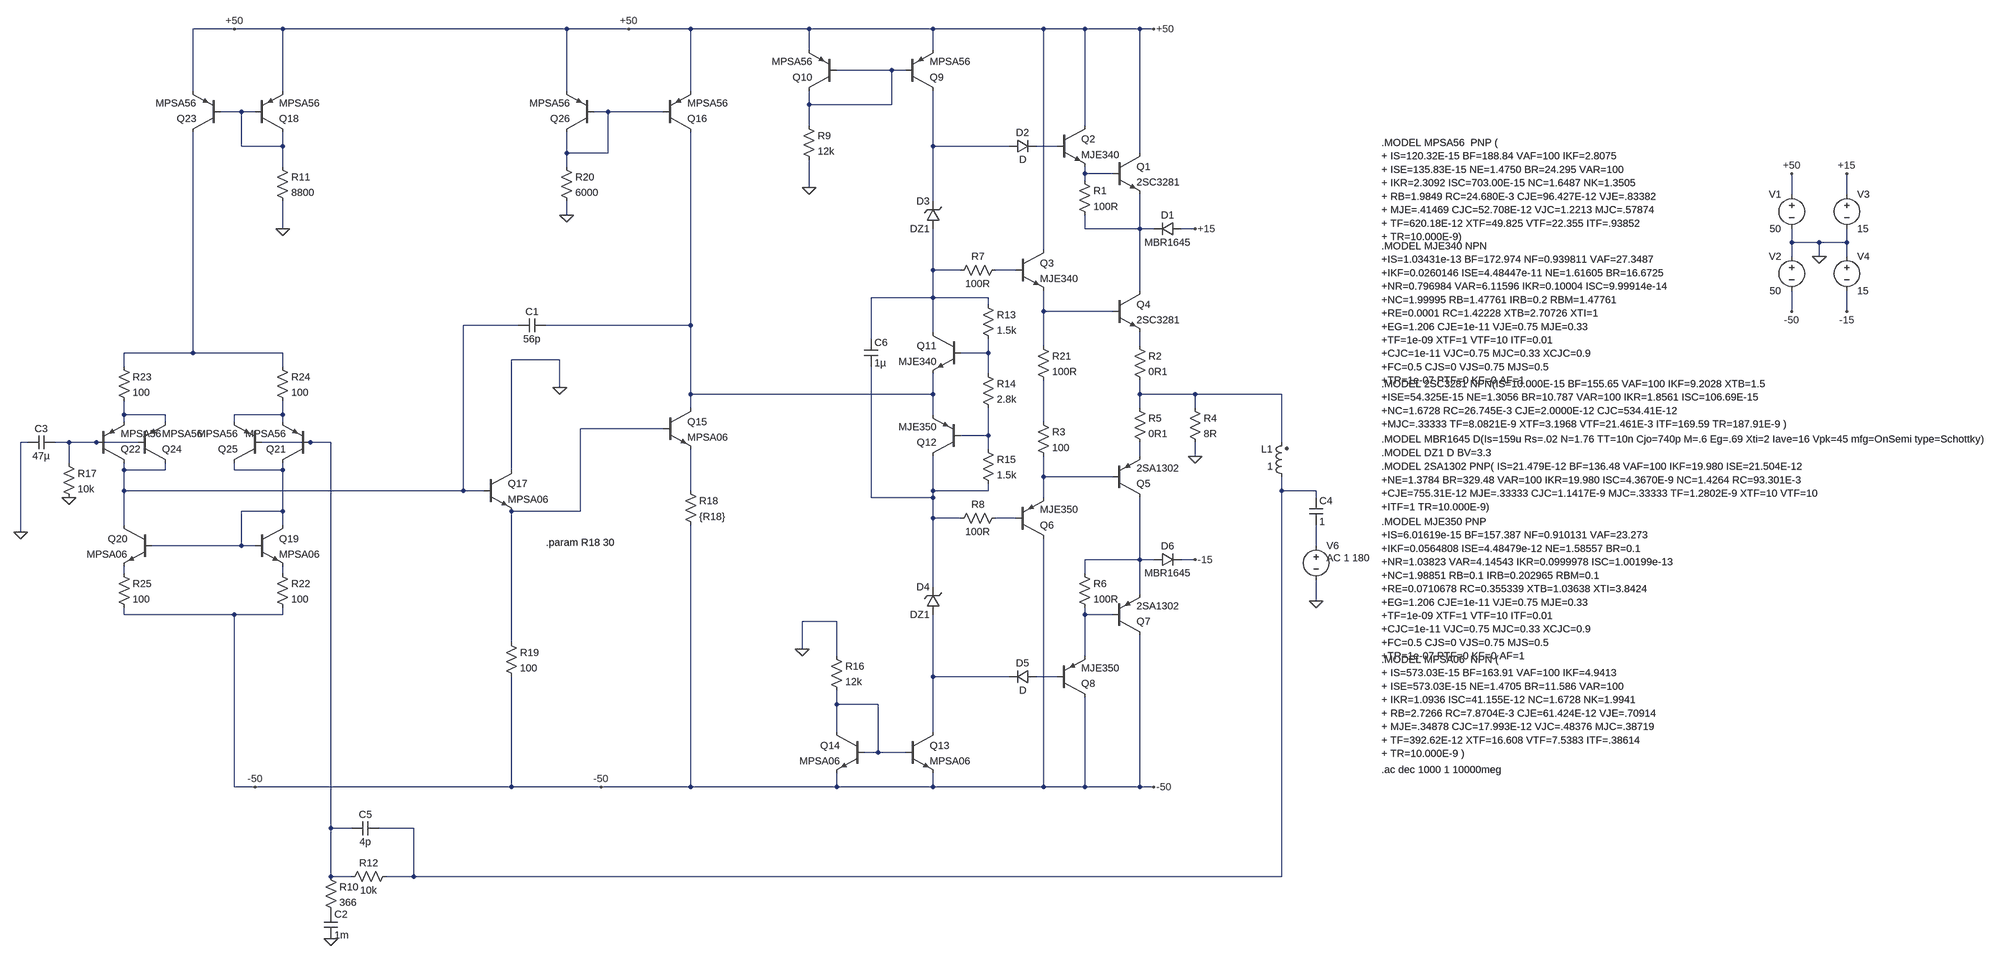
[diagram p0: schematic ganancia de lazo.asc]
ganancia de lazo.asc, the LTspice schematic file:
Version 4
SHEET 1 4608 680
WIRE 80 -1584 -16 -1584
WIRE 192 -1584 80 -1584
WIRE 896 -1584 192 -1584
WIRE 1040 -1584 896 -1584
WIRE 1184 -1584 1040 -1584
WIRE 1472 -1584 1184 -1584
WIRE 1760 -1584 1472 -1584
WIRE 2016 -1584 1760 -1584
WIRE 2112 -1584 2016 -1584
WIRE 2240 -1584 2112 -1584
WIRE 2272 -1584 2240 -1584
WIRE 1472 -1536 1472 -1584
WIRE 1760 -1536 1760 -1584
WIRE 1664 -1488 1536 -1488
WIRE 1696 -1488 1664 -1488
WIRE -16 -1440 -16 -1584
WIRE 192 -1440 192 -1584
WIRE 896 -1440 896 -1584
WIRE 1184 -1440 1184 -1584
WIRE 1472 -1408 1472 -1440
WIRE 1664 -1408 1664 -1488
WIRE 1664 -1408 1472 -1408
WIRE 96 -1392 48 -1392
WIRE 128 -1392 96 -1392
WIRE 992 -1392 960 -1392
WIRE 1120 -1392 992 -1392
WIRE 1472 -1360 1472 -1408
WIRE 2112 -1360 2112 -1584
WIRE 96 -1312 96 -1392
WIRE 192 -1312 192 -1344
WIRE 192 -1312 96 -1312
WIRE 1760 -1312 1760 -1440
WIRE 1936 -1312 1760 -1312
WIRE 2048 -1312 2000 -1312
WIRE 896 -1296 896 -1344
WIRE 992 -1296 992 -1392
WIRE 992 -1296 896 -1296
WIRE 2240 -1296 2240 -1584
WIRE 192 -1264 192 -1312
WIRE 896 -1264 896 -1296
WIRE 2112 -1248 2112 -1264
WIRE 2176 -1248 2112 -1248
WIRE 2112 -1232 2112 -1248
WIRE 1472 -1216 1472 -1280
WIRE 3936 -1200 3936 -1248
WIRE 4064 -1200 4064 -1248
WIRE 1760 -1184 1760 -1312
WIRE 896 -1152 896 -1184
WIRE 192 -1120 192 -1184
WIRE 2112 -1120 2112 -1152
WIRE 2240 -1120 2240 -1200
WIRE 2240 -1120 2112 -1120
WIRE 2272 -1120 2240 -1120
WIRE 2368 -1120 2336 -1120
WIRE 3936 -1088 3936 -1120
WIRE 4000 -1088 3936 -1088
WIRE 4064 -1088 4064 -1120
WIRE 4064 -1088 4000 -1088
WIRE 2016 -1072 2016 -1584
WIRE 3936 -1056 3936 -1088
WIRE 4000 -1056 4000 -1088
WIRE 4064 -1056 4064 -1088
WIRE 1760 -1024 1760 -1120
WIRE 1824 -1024 1760 -1024
WIRE 1952 -1024 1904 -1024
WIRE 2240 -976 2240 -1120
WIRE 1760 -960 1760 -1024
WIRE 1760 -960 1616 -960
WIRE 1888 -960 1760 -960
WIRE 1888 -944 1888 -960
WIRE 2016 -928 2016 -976
WIRE 2176 -928 2016 -928
WIRE 3936 -928 3936 -976
WIRE 4064 -928 4064 -976
WIRE 784 -896 656 -896
WIRE 1184 -896 1184 -1344
WIRE 1184 -896 848 -896
WIRE 1760 -880 1760 -960
WIRE 1616 -864 1616 -960
WIRE 2016 -848 2016 -928
WIRE 2240 -848 2240 -880
WIRE -16 -832 -16 -1344
WIRE -16 -832 -176 -832
WIRE 192 -832 -16 -832
WIRE 1888 -832 1888 -864
WIRE 1888 -832 1824 -832
WIRE 880 -816 768 -816
WIRE -176 -800 -176 -832
WIRE 192 -800 192 -832
WIRE 1888 -784 1888 -832
WIRE 880 -752 880 -816
WIRE 1184 -736 1184 -896
WIRE 1760 -736 1760 -784
WIRE 1760 -736 1184 -736
WIRE 2240 -736 2240 -768
WIRE 2368 -736 2240 -736
WIRE 2752 -736 2368 -736
WIRE 1184 -704 1184 -736
WIRE 2240 -704 2240 -736
WIRE 2368 -704 2368 -736
WIRE -176 -688 -176 -720
WIRE -80 -688 -176 -688
WIRE 192 -688 192 -720
WIRE 192 -688 80 -688
WIRE 1760 -688 1760 -736
WIRE -176 -672 -176 -688
WIRE -80 -672 -80 -688
WIRE 80 -672 80 -688
WIRE 192 -672 192 -688
WIRE 2016 -672 2016 -768
WIRE 1120 -656 928 -656
WIRE 1888 -640 1888 -704
WIRE 1888 -640 1824 -640
WIRE -400 -624 -416 -624
WIRE -304 -624 -336 -624
WIRE -240 -624 -304 -624
WIRE -144 -624 -240 -624
WIRE 256 -624 144 -624
WIRE 304 -624 256 -624
WIRE 2752 -624 2752 -736
WIRE 1888 -608 1888 -640
WIRE 2240 -592 2240 -624
WIRE 2368 -592 2368 -624
WIRE -304 -576 -304 -624
WIRE -176 -560 -176 -576
WIRE -80 -560 -80 -576
WIRE -80 -560 -176 -560
WIRE 80 -560 80 -576
WIRE 192 -560 192 -576
WIRE 192 -560 80 -560
WIRE 768 -560 768 -816
WIRE 2016 -544 2016 -592
WIRE 2176 -544 2016 -544
WIRE -176 -512 -176 -560
WIRE 656 -512 656 -896
WIRE 656 -512 -176 -512
WIRE 704 -512 656 -512
WIRE 1184 -512 1184 -608
WIRE 1760 -512 1760 -592
WIRE 1888 -512 1888 -528
WIRE 1888 -512 1760 -512
WIRE 2752 -512 2752 -544
WIRE 2832 -512 2752 -512
WIRE 1616 -496 1616 -800
WIRE 1760 -496 1760 -512
WIRE 1760 -496 1616 -496
WIRE 2016 -496 2016 -544
WIRE 2832 -496 2832 -512
WIRE 192 -464 192 -560
WIRE 192 -464 96 -464
WIRE 928 -464 928 -656
WIRE 928 -464 768 -464
WIRE 1760 -448 1760 -496
WIRE 1824 -448 1760 -448
WIRE 1952 -448 1904 -448
WIRE -176 -432 -176 -512
WIRE 192 -432 192 -464
WIRE -416 -416 -416 -624
WIRE 96 -384 96 -464
WIRE 96 -384 -112 -384
WIRE 128 -384 96 -384
WIRE 2832 -384 2832 -432
WIRE 2240 -352 2240 -496
WIRE 2240 -352 2112 -352
WIRE 2272 -352 2240 -352
WIRE 2368 -352 2336 -352
WIRE -176 -320 -176 -336
WIRE 192 -320 192 -336
WIRE 2112 -320 2112 -352
WIRE 1760 -288 1760 -448
WIRE 2240 -272 2240 -352
WIRE 2832 -256 2832 -304
WIRE -176 -224 -176 -240
WIRE 80 -224 -176 -224
WIRE 192 -224 192 -240
WIRE 192 -224 80 -224
WIRE 2112 -224 2112 -240
WIRE 2176 -224 2112 -224
WIRE 1536 -208 1456 -208
WIRE 768 -160 768 -464
WIRE 1456 -144 1456 -208
WIRE 1536 -128 1536 -208
WIRE 2112 -128 2112 -224
WIRE 1760 -80 1760 -224
WIRE 1936 -80 1760 -80
WIRE 2048 -80 2000 -80
WIRE 1536 -16 1536 -48
WIRE 1632 -16 1536 -16
WIRE 1536 48 1536 -16
WIRE 1760 48 1760 -80
WIRE 1632 96 1632 -16
WIRE 1632 96 1600 96
WIRE 1696 96 1632 96
WIRE 80 176 80 -224
WIRE 128 176 80 176
WIRE 768 176 768 -80
WIRE 768 176 128 176
WIRE 976 176 768 176
WIRE 1184 176 1184 -432
WIRE 1184 176 976 176
WIRE 1536 176 1536 144
WIRE 1536 176 1184 176
WIRE 1760 176 1760 144
WIRE 1760 176 1536 176
WIRE 2016 176 2016 -400
WIRE 2016 176 1760 176
WIRE 2112 176 2112 -32
WIRE 2112 176 2016 176
WIRE 2240 176 2240 -176
WIRE 2240 176 2112 176
WIRE 2272 176 2240 176
WIRE 304 272 304 -624
WIRE 352 272 304 272
WIRE 496 272 416 272
WIRE 304 384 304 272
WIRE 352 384 304 384
WIRE 496 384 496 272
WIRE 496 384 432 384
WIRE 2752 384 2752 -512
WIRE 2752 384 496 384
FLAG 2368 -592 0
FLAG 2272 176 -50
FLAG 2368 -352 -15
FLAG 2272 -1584 +50
FLAG 2368 -1120 +15
FLAG 1456 -144 0
FLAG 3936 -1248 +50
FLAG 3936 -928 -50
FLAG 4064 -1248 +15
FLAG 4064 -928 -15
FLAG 4000 -1056 0
FLAG 880 -752 0
FLAG -416 -416 0
FLAG 1472 -1216 0
FLAG 192 -1120 0
FLAG -304 -496 0
FLAG 304 528 0
FLAG 896 -1152 0
FLAG 1040 -1584 +50
FLAG 976 176 -50
FLAG 128 176 -50
FLAG 80 -1584 +50
FLAG 2832 -256 0
SYMBOL npn 2176 -1296 R0
SYMATTR InstName Q1
SYMATTR Value 2SC3281
SYMBOL npn 2048 -1360 R0
SYMATTR InstName Q2
SYMATTR Value MJE340
SYMBOL res 2096 -1248 R0
SYMATTR InstName R1
SYMATTR Value 100R
SYMBOL diode 2336 -1136 R90
WINDOW 0 0 32 VBottom 2
WINDOW 3 32 32 VTop 2
SYMATTR InstName D1
SYMATTR Value MBR1645
SYMBOL diode 1936 -1296 R270
WINDOW 0 32 32 VTop 2
WINDOW 3 0 32 VBottom 2
SYMATTR InstName D2
SYMBOL zener 1776 -1120 R180
WINDOW 0 24 64 Left 2
WINDOW 3 24 0 Left 2
SYMATTR InstName D3
SYMATTR Value DZ1
SYMBOL npn 1952 -1072 R0
SYMATTR InstName Q3
SYMATTR Value MJE340
SYMBOL npn 2176 -976 R0
SYMATTR InstName Q4
SYMATTR Value 2SC3281
SYMBOL res 2224 -864 R0
SYMATTR InstName R2
SYMATTR Value 0R1
SYMBOL res 2000 -688 R0
SYMATTR InstName R3
SYMATTR Value 100
SYMBOL res 2352 -720 R0
SYMATTR InstName R4
SYMATTR Value 8R
SYMBOL res 2224 -720 R0
SYMATTR InstName R5
SYMATTR Value 0R1
SYMBOL pnp 2176 -496 M180
SYMATTR InstName Q5
SYMATTR Value 2SA1302
SYMBOL pnp 1952 -400 M180
SYMATTR InstName Q6
SYMATTR Value MJE350
SYMBOL pnp 2176 -176 M180
SYMATTR InstName Q7
SYMATTR Value 2SA1302
SYMBOL pnp 2048 -32 M180
SYMATTR InstName Q8
SYMATTR Value MJE350
SYMBOL res 2096 -336 R0
SYMATTR InstName R6
SYMATTR Value 100R
SYMBOL zener 1776 -224 R180
WINDOW 0 24 64 Left 2
WINDOW 3 24 0 Left 2
SYMATTR InstName D4
SYMATTR Value DZ1
SYMBOL diode 2000 -96 R90
WINDOW 0 0 32 VBottom 2
WINDOW 3 32 32 VTop 2
SYMATTR InstName D5
SYMBOL diode 2272 -336 R270
WINDOW 0 32 32 VTop 2
WINDOW 3 0 32 VBottom 2
SYMATTR InstName D6
SYMATTR Value MBR1645
SYMBOL res 1920 -1040 R90
WINDOW 0 0 56 VBottom 2
WINDOW 3 32 56 VTop 2
SYMATTR InstName R7
SYMATTR Value 100R
SYMBOL res 1920 -464 R90
WINDOW 0 0 56 VBottom 2
WINDOW 3 32 56 VTop 2
SYMATTR InstName R8
SYMATTR Value 100R
SYMBOL npn 1824 -880 M0
SYMATTR InstName Q11
SYMATTR Value MJE340
SYMBOL pnp 1824 -592 R180
SYMATTR InstName Q12
SYMATTR Value MJE350
SYMBOL res 1872 -960 R0
SYMATTR InstName R13
SYMATTR Value 1.5k
SYMBOL res 1872 -800 R0
SYMATTR InstName R14
SYMATTR Value 2.8k
SYMBOL res 1872 -624 R0
SYMATTR InstName R15
SYMATTR Value 1.5k
SYMBOL npn 1696 48 R0
SYMATTR InstName Q13
SYMATTR Value MPSA06
SYMBOL npn 1600 48 M0
SYMATTR InstName Q14
SYMATTR Value MPSA06
SYMBOL res 1520 -144 R0
SYMATTR InstName R16
SYMATTR Value 12k
SYMBOL voltage 3936 -1216 M0
SYMATTR InstName V1
SYMATTR Value 50
SYMBOL voltage 3936 -1072 M0
SYMATTR InstName V2
SYMATTR Value 50
SYMBOL voltage 4064 -1216 R0
SYMATTR InstName V3
SYMATTR Value 15
SYMBOL voltage 4064 -1072 R0
SYMATTR InstName V4
SYMATTR Value 15
SYMBOL npn 1120 -704 R0
SYMATTR InstName Q15
SYMATTR Value MPSA06
SYMBOL res 1168 -528 R0
SYMATTR InstName R18
SYMATTR Value {R18}
SYMBOL npn 704 -560 R0
SYMATTR InstName Q17
SYMATTR Value MPSA06
SYMBOL res 752 -176 R0
SYMATTR InstName R19
SYMATTR Value 100
SYMBOL res 2000 -864 R0
SYMATTR InstName R21
SYMATTR Value 100R
SYMBOL npn 128 -432 R0
SYMATTR InstName Q19
SYMATTR Value MPSA06
SYMBOL npn -112 -432 M0
SYMATTR InstName Q20
SYMATTR Value MPSA06
SYMBOL pnp 256 -576 R180
SYMATTR InstName Q21
SYMATTR Value MPSA56
SYMBOL pnp -240 -576 M180
SYMATTR InstName Q22
SYMATTR Value MPSA56
SYMBOL res 176 -336 R0
SYMATTR InstName R22
SYMATTR Value 100
SYMBOL res -192 -816 R0
SYMATTR InstName R23
SYMATTR Value 100
SYMBOL res 176 -816 R0
SYMATTR InstName R24
SYMATTR Value 100
SYMBOL res -192 -336 R0
SYMATTR InstName R25
SYMATTR Value 100
SYMBOL pnp 1696 -1440 M180
SYMATTR InstName Q9
SYMATTR Value MPSA56
SYMBOL pnp 1536 -1440 R180
SYMATTR InstName Q10
SYMATTR Value MPSA56
SYMBOL res 1456 -1376 R0
SYMATTR InstName R9
SYMATTR Value 12k
SYMBOL pnp 1120 -1344 M180
SYMATTR InstName Q16
SYMATTR Value MPSA56
SYMBOL pnp 128 -1344 M180
SYMATTR InstName Q18
SYMATTR Value MPSA56
SYMBOL res 176 -1280 R0
SYMATTR InstName R11
SYMATTR Value 8800
SYMBOL pnp 48 -1344 R180
SYMATTR InstName Q23
SYMATTR Value MPSA56
SYMBOL res 288 368 R0
SYMATTR InstName R10
SYMATTR Value 366
SYMBOL res 448 368 R90
WINDOW 0 0 56 VBottom 2
WINDOW 3 32 56 VTop 2
SYMATTR InstName R12
SYMATTR Value 10k
SYMBOL pnp -144 -576 M180
SYMATTR InstName Q24
SYMATTR Value MPSA56
SYMBOL pnp 144 -576 R180
SYMATTR InstName Q25
SYMATTR Value MPSA56
SYMBOL res -320 -592 R0
SYMATTR InstName R17
SYMATTR Value 10k
SYMBOL cap 288 464 R0
SYMATTR InstName C2
SYMATTR Value 1m
SYMBOL cap -336 -640 R90
WINDOW 0 0 32 VBottom 2
WINDOW 3 32 32 VTop 2
SYMATTR InstName C3
SYMATTR Value 47µ
SYMBOL pnp 960 -1344 R180
SYMATTR InstName Q26
SYMATTR Value MPSA56
SYMBOL res 880 -1280 R0
SYMATTR InstName R20
SYMATTR Value 6000
SYMBOL ind2 2768 -528 R180
WINDOW 0 36 80 Left 2
WINDOW 3 36 40 Left 2
SYMATTR InstName L1
SYMATTR Value 1
SYMBOL cap 2816 -496 R0
SYMATTR InstName C4
SYMATTR Value 1
SYMBOL voltage 2832 -400 R0
WINDOW 123 24 44 Left 2
WINDOW 39 0 0 Left 2
SYMATTR Value2 AC 1 180
SYMATTR InstName V6
SYMATTR Value ""
SYMBOL cap 416 256 R90
WINDOW 0 0 32 VBottom 2
WINDOW 3 32 32 VTop 2
SYMATTR InstName C5
SYMATTR Value 4p
SYMBOL cap 848 -912 R90
WINDOW 0 0 32 VBottom 2
WINDOW 3 32 32 VTop 2
SYMATTR InstName C1
SYMATTR Value 56p
SYMBOL cap 1600 -864 R0
SYMATTR InstName C6
SYMATTR Value 1µ
TEXT 2984 136 Left 2 !.ac dec 1000 1 10000meg
TEXT 2984 -600 Left 2 !.MODEL DZ1 D BV=3.3
TEXT 2984 -1320 Left 2 !.MODEL MPSA56  PNP (\n+ IS=120.32E-15 BF=188.84 VAF=100 IKF=2.8075\n+ ISE=135.83E-15 NE=1.4750 BR=24.295 VAR=100\n+ IKR=2.3092 ISC=703.00E-15 NC=1.6487 NK=1.3505\n+ RB=1.9849 RC=24.680E-3 CJE=96.427E-12 VJE=.83382\n+ MJE=.41469 CJC=52.708E-12 VJC=1.2213 MJC=.57874\n+ TF=620.18E-12 XTF=49.825 VTF=22.355 ITF=.93852\n+ TR=10.000E-9)
TEXT 2984 -1080 Left 2 !.MODEL MJE340 NPN\n+IS=1.03431e-13 BF=172.974 NF=0.939811 VAF=27.3487\n+IKF=0.0260146 ISE=4.48447e-11 NE=1.61605 BR=16.6725\n+NR=0.796984 VAR=6.11596 IKR=0.10004 ISC=9.99914e-14\n+NC=1.99995 RB=1.47761 IRB=0.2 RBM=1.47761\n+RE=0.0001 RC=1.42228 XTB=2.70726 XTI=1\n+EG=1.206 CJE=1e-11 VJE=0.75 MJE=0.33\n+TF=1e-09 XTF=1 VTF=10 ITF=0.01\n+CJC=1e-11 VJC=0.75 MJC=0.33 XCJC=0.9\n+FC=0.5 CJS=0 VJS=0.75 MJS=0.5\n+TR=1e-07 PTF=0 KF=0 AF=1
TEXT 2984 -760 Left 2 !.MODEL 2SC3281 NPN(IS=10.000E-15 BF=155.65 VAF=100 IKF=9.2028 XTB=1.5\n+ISE=54.325E-15 NE=1.3056 BR=10.787 VAR=100 IKR=1.8561 ISC=106.69E-15\n+NC=1.6728 RC=26.745E-3 CJE=2.0000E-12 CJC=534.41E-12\n+MJC=.33333 TF=8.0821E-9 XTF=3.1968 VTF=21.461E-3 ITF=169.59 TR=187.91E-9 )
TEXT 2984 -632 Left 2 !.MODEL MBR1645 D(Is=159u Rs=.02 N=1.76 TT=10n Cjo=740p M=.6 Eg=.69 Xti=2 Iave=16 Vpk=45 mfg=OnSemi type=Schottky)
TEXT 2984 -568 Left 2 !.MODEL 2SA1302 PNP( IS=21.479E-12 BF=136.48 VAF=100 IKF=19.980 ISE=21.504E-12\n+NE=1.3784 BR=329.48 VAR=100 IKR=19.980 ISC=4.3670E-9 NC=1.4264 RC=93.301E-3\n+CJE=755.31E-12 MJE=.33333 CJC=1.1417E-9 MJC=.33333 TF=1.2802E-9 XTF=10 VTF=10\n+ITF=1 TR=10.000E-9)
TEXT 2984 -440 Left 2 !.MODEL MJE350 PNP\n+IS=6.01619e-15 BF=157.387 NF=0.910131 VAF=23.273\n+IKF=0.0564808 ISE=4.48479e-12 NE=1.58557 BR=0.1\n+NR=1.03823 VAR=4.14543 IKR=0.0999978 ISC=1.00199e-13\n+NC=1.98851 RB=0.1 IRB=0.202965 RBM=0.1\n+RE=0.0710678 RC=0.355339 XTB=1.03638 XTI=3.8424\n+EG=1.206 CJE=1e-11 VJE=0.75 MJE=0.33\n+TF=1e-09 XTF=1 VTF=10 ITF=0.01\n+CJC=1e-11 VJC=0.75 MJC=0.33 XCJC=0.9\n+FC=0.5 CJS=0 VJS=0.75 MJS=0.5\n+TR=1e-07 PTF=0 KF=0 AF=1
TEXT 2984 -120 Left 2 !.MODEL MPSA06  NPN (\n+ IS=573.03E-15 BF=163.91 VAF=100 IKF=4.9413\n+ ISE=573.03E-15 NE=1.4705 BR=11.586 VAR=100\n+ IKR=1.0936 ISC=41.155E-12 NC=1.6728 NK=1.9941\n+ RB=2.7266 RC=7.8704E-3 CJE=61.424E-12 VJE=.70914\n+ MJE=.34878 CJC=17.993E-12 VJC=.48376 MJC=.38719\n+ TF=392.62E-12 XTF=16.608 VTF=7.5383 ITF=.38614\n+ TR=10.000E-9 )
TEXT 848 -392 Left 2 !.param R18 30

The netlist it stands for:
* ganancia de lazo.asc
Q1 +50 N006 N007 0 2SC3281
Q2 +50 N005 N006 0 MJE340
R1 N006 N007 100R
D1 +15 N007 MBR1645
D2 N004 N005 D
D3 N008 N004 DZ1
Q3 +50 N009 N010 0 MJE340
Q4 N007 N010 N013 0 2SC3281
R2 N013 N016 0R1
R3 N019 N026 100
R4 N016 0 8R
R5 N016 N024 0R1
Q5 N032 N026 N024 0 2SA1302
Q6 -50 N030 N026 0 MJE350
Q7 -50 N035 N032 0 2SA1302
Q8 -50 N037 N035 0 MJE350
R6 N032 N035 100R
D4 N036 N028 DZ1
D5 N037 N036 D
D6 N032 -15 MBR1645
R7 N009 N008 100R
R8 N030 N028 100R
Q11 N008 N015 N012 0 MJE340
Q12 N028 N021 N012 0 MJE350
R13 N008 N015 1.5k
R14 N015 N021 2.8k
R15 N021 N028 1.5k
Q13 N036 N038 -50 0 MPSA06
Q14 N038 N038 -50 0 MPSA06
R16 0 N038 12k
V1 +50 0 50
V2 0 -50 50
V3 +15 0 15
V4 0 -15 15
Q15 N012 N020 N027 0 MPSA06
R18 N027 -50 {R18}
Q17 0 N011 N020 0 MPSA06
R19 N020 -50 100
R21 N010 N019 100R
Q19 N025 N025 N034 0 MPSA06
Q20 N011 N025 N033 0 MPSA06
Q21 N025 N023 N018 0 MPSA56
Q22 N011 N022 N017 0 MPSA56
R22 N034 -50 100
R23 N014 N017 100
R24 N014 N018 100
R25 N033 -50 100
Q9 N004 N001 +50 0 MPSA56
Q10 N001 N001 +50 0 MPSA56
R9 N001 0 12k
Q16 N012 N003 +50 0 MPSA56
Q18 N002 N002 +50 0 MPSA56
R11 N002 0 8800
Q23 N014 N002 +50 0 MPSA56
R10 N023 P001 366
R12 N029 N023 10k
Q24 N011 N022 N017 0 MPSA56
Q25 N025 N023 N018 0 MPSA56
R17 N022 0 10k
C2 P001 0 1m
C3 N022 0 47µ
Q26 N003 N003 +50 0 MPSA56
R20 N003 0 6000
L1 N029 N016 1
C4 N029 N031 1
V6 N031 0 AC 1 180
C5 N029 N023 4p
C1 N012 N011 56p
C6 N008 N028 1µ
.model D D
.lib standard.dio
.model NPN NPN
.model PNP PNP
.lib standard.bjt
.ac dec 1000 1 10000meg
.MODEL DZ1 D BV=3.3
.MODEL MPSA56  PNP (
+ IS=120.32E-15 BF=188.84 VAF=100 IKF=2.8075
+ ISE=135.83E-15 NE=1.4750 BR=24.295 VAR=100
+ IKR=2.3092 ISC=703.00E-15 NC=1.6487 NK=1.3505
+ RB=1.9849 RC=24.680E-3 CJE=96.427E-12 VJE=.83382
+ MJE=.41469 CJC=52.708E-12 VJC=1.2213 MJC=.57874
+ TF=620.18E-12 XTF=49.825 VTF=22.355 ITF=.93852
+ TR=10.000E-9)
.MODEL MJE340 NPN
+IS=1.03431e-13 BF=172.974 NF=0.939811 VAF=27.3487
+IKF=0.0260146 ISE=4.48447e-11 NE=1.61605 BR=16.6725
+NR=0.796984 VAR=6.11596 IKR=0.10004 ISC=9.99914e-14
+NC=1.99995 RB=1.47761 IRB=0.2 RBM=1.47761
+RE=0.0001 RC=1.42228 XTB=2.70726 XTI=1
+EG=1.206 CJE=1e-11 VJE=0.75 MJE=0.33
+TF=1e-09 XTF=1 VTF=10 ITF=0.01
+CJC=1e-11 VJC=0.75 MJC=0.33 XCJC=0.9
+FC=0.5 CJS=0 VJS=0.75 MJS=0.5
+TR=1e-07 PTF=0 KF=0 AF=1
.MODEL 2SC3281 NPN(IS=10.000E-15 BF=155.65 VAF=100 IKF=9.2028 XTB=1.5
+ISE=54.325E-15 NE=1.3056 BR=10.787 VAR=100 IKR=1.8561 ISC=106.69E-15
+NC=1.6728 RC=26.745E-3 CJE=2.0000E-12 CJC=534.41E-12
+MJC=.33333 TF=8.0821E-9 XTF=3.1968 VTF=21.461E-3 ITF=169.59 TR=187.91E-9 )
.MODEL MBR1645 D(Is=159u Rs=.02 N=1.76 TT=10n Cjo=740p M=.6 Eg=.69 Xti=2 Iave=16 Vpk=45 mfg=OnSemi type=Schottky)
.MODEL 2SA1302 PNP( IS=21.479E-12 BF=136.48 VAF=100 IKF=19.980 ISE=21.504E-12
+NE=1.3784 BR=329.48 VAR=100 IKR=19.980 ISC=4.3670E-9 NC=1.4264 RC=93.301E-3
+CJE=755.31E-12 MJE=.33333 CJC=1.1417E-9 MJC=.33333 TF=1.2802E-9 XTF=10 VTF=10
+ITF=1 TR=10.000E-9)
.MODEL MJE350 PNP
+IS=6.01619e-15 BF=157.387 NF=0.910131 VAF=23.273
+IKF=0.0564808 ISE=4.48479e-12 NE=1.58557 BR=0.1
+NR=1.03823 VAR=4.14543 IKR=0.0999978 ISC=1.00199e-13
+NC=1.98851 RB=0.1 IRB=0.202965 RBM=0.1
+RE=0.0710678 RC=0.355339 XTB=1.03638 XTI=3.8424
+EG=1.206 CJE=1e-11 VJE=0.75 MJE=0.33
+TF=1e-09 XTF=1 VTF=10 ITF=0.01
+CJC=1e-11 VJC=0.75 MJC=0.33 XCJC=0.9
+FC=0.5 CJS=0 VJS=0.75 MJS=0.5
+TR=1e-07 PTF=0 KF=0 AF=1
.MODEL MPSA06  NPN (
+ IS=573.03E-15 BF=163.91 VAF=100 IKF=4.9413
+ ISE=573.03E-15 NE=1.4705 BR=11.586 VAR=100
+ IKR=1.0936 ISC=41.155E-12 NC=1.6728 NK=1.9941
+ RB=2.7266 RC=7.8704E-3 CJE=61.424E-12 VJE=.70914
+ MJE=.34878 CJC=17.993E-12 VJC=.48376 MJC=.38719
+ TF=392.62E-12 XTF=16.608 VTF=7.5383 ITF=.38614
+ TR=10.000E-9 )
.param R18 30
.backanno
.end